# Altium schematic sheet Interfaces.SchDoc
size A3; SheetNumber: 7; SheetTotal: 9
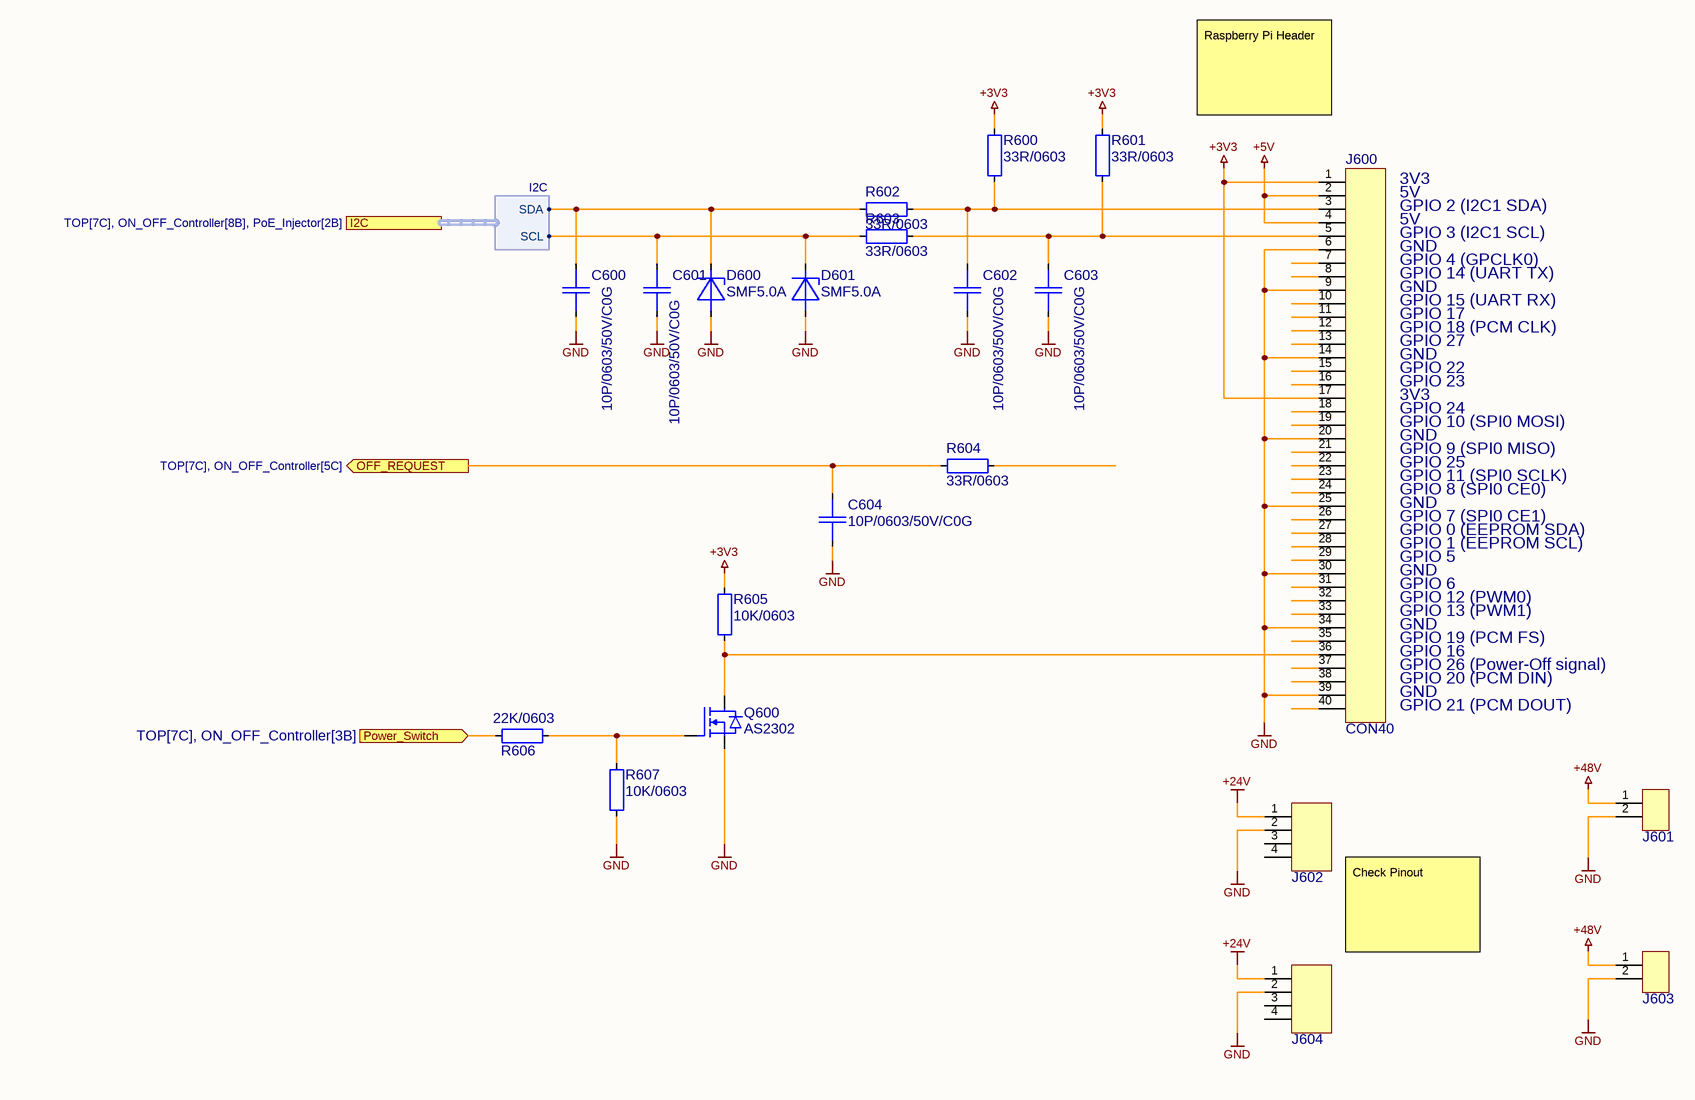
[diagram p0: Interfaces.SchDoc]

## Parts
C600  10P/0603/50V/C0G  [CAP0603_C0G]
C601  10P/0603/50V/C0G  [CAP0603_C0G]
C602  10P/0603/50V/C0G  [CAP0603_C0G]
C603  10P/0603/50V/C0G  [CAP0603_C0G]
C604  10P/0603/50V/C0G  [CAP0603_C0G]
D600  SMF5.0A  [SOD3720X110]
D601  SMF5.0A  [SOD3720X110]
J600  CON40  [HEAD_254_2X20]
J601  430450212  [430450212]  (value not drawn)
J602  430450412  [430450412]  (value not drawn)
J603  430450212  [430450212]  (value not drawn)
J604  430450412  [430450412]  (value not drawn)
Q600  AS2302  [SOT2395P280X125-3-SE]
R600  33R/0603  [R0603-0.40-WW]
R601  33R/0603  [R0603-0.40-WW]
R602  33R/0603  [R0603-0.40-WW]
R603  33R/0603  [R0603-0.40-WW]
R604  33R/0603  [R0603-0.40-WW]
R605  10K/0603  [R0603-0.40-WW]
R606  22K/0603  [R0603-0.40-WW]
R607  10K/0603  [R0603-0.40-WW]

## Ports
I2C (harness I2C, see TOP[7C], ON_OFF_Controller[8B], PoE_Injector[2B]), OFF_REQUEST (out, see TOP[7C], ON_OFF_Controller[5C]), Power_Switch (in, see TOP[7C], ON_OFF_Controller[3B])

## Harnesses
I2C: SDA, SCL

## Nets
+3V3: J600.1 J600.17 R600.2 R601.2 R605.1
+5V: J600.2 J600.4
+24V: J602.1 J604.1
+48V: J601.1 J603.1
GND: C600.2 C601.2 C602.2 C603.2 C604.2 D600.2 D601.2 J600.6 J600.9 J600.14 J600.20 J600.25 J600.30 J600.34 J600.39 J601.2 J602.2 J603.2 J604.2 Q600.2(SOURCE) R607.2
OFF_REQUEST: C604.1 R604.1 ; port OFF_REQUEST
Power_Switch: R606.1 ; port Power_Switch
NetC600_1: C600.1 D600.1 R602.1 ; port I2C.SDA
NetC601_1: C601.1 D601.1 R603.1 ; port I2C.SCL
NetC602_1: C602.1 J600.3 R600.1 R602.2
NetC603_1: C603.1 J600.5 R601.1 R603.2
NetJ600_36: J600.36 Q600.3(DRAIN) R605.2
NetQ600_1: Q600.1(GATE) R606.2 R607.1

Not connected (* = marked no-connect by the designer): J600 7 8 10 11 12 13 15 16 18 19 21 22 23 24 26 27 28 29 31 32 33 35 37 38 40; J602 3 4; J604 3 4; R604 2

## Notes on the sheet
- Raspberry Pi Header
- 3V3
- 5V
- GPIO 2 (I2C1 SDA)
- GPIO 3 (I2C1 SCL)
- GND
- GPIO 4 (GPCLK0)
- GPIO 14 (UART TX)
- GPIO 15 (UART RX)
- GPIO 17
- GPIO 18 (PCM CLK)
- GPIO 27
- GPIO 22
- GPIO 23
- GPIO 24
- GPIO 10 (SPI0 MOSI)
- GPIO 9 (SPI0 MISO)
- GPIO 25
- GPIO 11 (SPI0 SCLK)
- GPIO 8 (SPI0 CE0)
- GPIO 7 (SPI0 CE1)
- GPIO 0 (EEPROM SDA)
- GPIO 1 (EEPROM SCL)
- GPIO 5
- GPIO 6
- GPIO 12 (PWM0)
- GPIO 13 (PWM1)
- GPIO 19 (PCM FS)
- GPIO 16
- GPIO 26 (Power-Off signal)
- GPIO 20 (PCM DIN)
- GPIO 21 (PCM DOUT)
- Check Pinout
- Date:
- Size:
- A3
- Schema:
- Layout:

## Library data of the parts
C600-C604 = 10P/0603/50V/C0G: CAP SM 0603 10pF 50V C0G; Manufacturer: GENERIC; Manufacturer 1: YAGEO; Manufacturer Part Number 1: CC0603JRNPO9BN100; Absolute Value: 1E-11; Eurocircuits GPN: GPC0603100-C0G; Part Number: 10P/0603/50V/C0G; Package: 0603; Value: 10pF; HelpURL: https://www.yageo.com/upload/media/product/productsearch/datasheet/mlcc/UPY-GP_NP0_16V-to-50V_18.pdf; Supplier 1: Digi-Key; Supplier Part Number 1: 311-1058-1-ND; Manufacturer 2: YAGEO; Manufacturer Part Number 2: CC0603KRNPO9BN100; Supplier 2: Digi-Key; Supplier Part Number 2: 311-4025-1-ND
D600 D601 = SMF5.0A: TVS DIODE 5VWM 9.2VC SOD123F; Manufacturer: Littelfuse Inc.; Manufacturer Part Number 1: SMF5.0A-T13; Absolute Value: 5V; Part Number: SMF5.0A; Package: SOD-123F; Value: SMF5.0A; HelpURL: https://www.littelfuse.com/~/media/electronics/datasheets/tvs_diodes/littelfuse_tvs_diode_smf_datasheet.pdf.pdf; Manufacturer 1: Littelfuse Inc.; Supplier 1: Digi-Key; Supplier Part Number 1: 18-SMF5.0A-T13CT-ND; Manufacturer 2: Littelfuse Inc.; Manufacturer Part Number 2: SMF5.0A; Supplier 2: Digi-Key; Supplier Part Number 2: F5748CT-ND; Manufacturer 3: MDD（Microdiode Electronics）; Manufacturer Part Number 3: SMF5.0A; Supplier 3: LCSC; Supplier Part Number 3: C193402; JLC Type: Extended
J600 = Header_2x20: Header 100 mil; Manufacturer: GENERIC; Part Number: Header_2x20
J601 J603 = Microfit_3.0_1x2_VERT_THT: Micro-Fit 3.0 Vertical Header, 3.00mm Pitch, Dual Row, 2 Circuits, with PCB Polarizing Peg, Tin, Glow-Wire Capable, Black; Manufacturer 1: Molex; Part Number: Microfit_3.0_1x2_VERT_THT; HelpURL: https://tools.molex.com/pdm_docs/ps/PS-43045.pdf; Manufacturer Part Number 1: 430450212; Supplier 1: Digi-Key; Supplier Part Number 1: WM1789-ND
J602 J604 = Microfit_3.0_2x2_VERT_THT: Micro-Fit 3.0 Vertical Header, 3.00mm Pitch, Dual Row, 4 Circuits, with PCB Polarizing Peg, Tin, Glow-Wire Capable, Black; Manufacturer 1: Molex; Part Number: Microfit_3.0_2x2_VERT_THT; HelpURL: https://tools.molex.com/pdm_docs/sd/430450412_sd.pdf; Manufacturer Part Number 1: 430450412; Supplier 1: Digi-Key; Supplier Part Number 1: WM1790-ND
Q600 = AS2302: N-Channel 20V(D-S) MOSFET; Manufacturer: GENERIC; Manufacturer 1: ANBON SEMICONDUCTOR (INT'L) LIMITED; Part Number: AS2302; Package: SOT23; HelpURL: https://datasheet.lcsc.com/lcsc/1809211431_AnBon-AS2302_C232266.pdf; Manufacturer Part Number 1: AS2302; Supplier 1: Digi-Key; Supplier Part Number 1: 4530-AS2302CT-ND; Manufacturer 3: AnBon; Manufacturer Part Number 3: AS2302; Supplier 3: LCSC; Supplier Part Number 3: C232266; JLC Type: Extended
R600-R604 = 33R/0603: RES SM 0603 33R; Manufacturer: GENERIC; Manufacturer 1: YAGEO; Manufacturer Part Number 1: RC0603FR-1333RL; Absolute Value: 33; Eurocircuits GPN: GPR060333R; Part Number: 33R/0603; Package: 0603; Value: 33R; HelpURL: https://www.yageo.com/upload/media/product/app/datasheet/rchip/pyu-rc_group_51_rohs_l.pdf; Supplier 1: Digi-Key; Supplier Part Number 1: 13-RC0603FR-1333RLCT-ND; Manufacturer 2: YAGEO; Manufacturer Part Number 2: RC0603FR-1033RL; Supplier 2: Digi-Key; Supplier Part Number 2: 13-RC0603FR-1033RLCT-ND
R605 R607 = 10K/0603: RES SM 0603 10K; Manufacturer: GENERIC; Manufacturer 1: YAGEO; Manufacturer Part Number 1: RC0603FR-1310KL; Absolute Value: 10000; Eurocircuits GPN: GPR060310K; Part Number: 10K/0603; Package: 0603; Value: 10K; HelpURL: https://www.yageo.com/upload/media/product/productsearch/datasheet/rchip/PYu-RC_Group_51_RoHS_L_12.pdf; Supplier 1: Digi-Key; Supplier Part Number 1: 13-RC0603FR-1310KLCT-ND; Manufacturer 2: YAGEO; Manufacturer Part Number 2: RC0603FR-1010KL; Supplier 2: Digi-Key; Supplier Part Number 2: 13-RC0603FR-1010KLCT-ND; Manufacturer 3: UNI-ROYAL(Uniroyal Elec); Manufacturer Part Number 3: 0603WAF1002T5E; Supplier 3: LCSC; Supplier Part Number 3: C25804; JLC Type: Basic
R606 = 22K/0603: RES SM 0603 22K; Manufacturer: GENERIC; Manufacturer 1: YAGEO; Manufacturer Part Number 1: RC0603FR-1322KL; Absolute Value: 22000; Eurocircuits GPN: GPR060322K; Part Number: 22K/0603; Package: 0603; Value: 22K; HelpURL: https://www.yageo.com/upload/media/product/app/datasheet/rchip/pyu-rc_group_51_rohs_l.pdf; Supplier 1: Digi-Key; Supplier Part Number 1: 13-RC0603FR-1322KLCT-ND; Manufacturer 2: YAGEO; Manufacturer Part Number 2: RC0603FR-1022KL; Supplier 2: Digi-Key; Supplier Part Number 2: 13-RC0603FR-1022KLCT-ND; Manufacturer 3: UNI-ROYAL(Uniroyal Elec); Manufacturer Part Number 3: 0603WAF2202T5E; Supplier 3: LCSC; Supplier Part Number 3: C31850; JLC Type: Basic